# Altium project scope-hub.PrjPcb
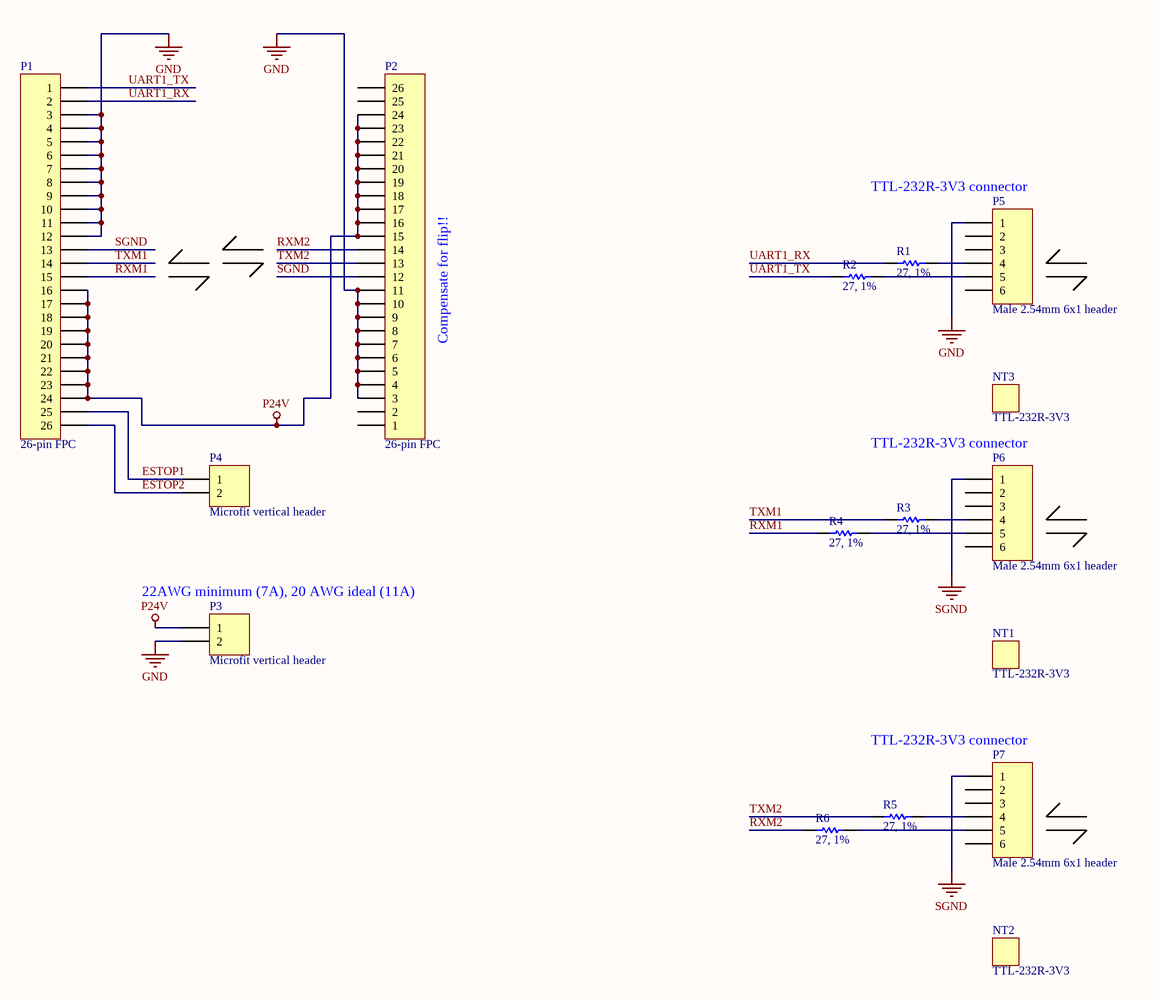
[diagram p0: hub.SchDoc]
1 sheet, 16 parts. Net scope: global (net labels, ports and power ports of the same name join across sheets).
Board file: scope-hub.PcbDoc

## Sheet hub.SchDoc
size A3; SheetNumber: 1; SheetTotal: 1

### Parts
NT1  TTL-232R-3V3
NT2  TTL-232R-3V3
NT3  TTL-232R-3V3
P1  26-pin FPC  [HRS_FH34SRJ-26S-0.5SH(50)]
P2  26-pin FPC  [HRS_FH34SRJ-26S-0.5SH(50)]
P3  Microfit vertical header  [MOLEX_0436500217]
P4  Microfit vertical header  [MOLEX_0436500217]
P5  Male 2.54mm 6x1 header  [HDR1X6]
P6  Male 2.54mm 6x1 header  [HDR1X6]
P7  Male 2.54mm 6x1 header  [HDR1X6]
R1  27, 1%  [B_RES0603]
R2  27, 1%  [B_RES0603]
R3  27, 1%  [B_RES0603]
R4  27, 1%  [B_RES0603]
R5  27, 1%  [B_RES0603]
R6  27, 1%  [B_RES0603]

### Nets
GND: P1.3 P1.4 P1.5 P1.6 P1.7 P1.8 P1.9 P1.10 P1.11 P1.12 P2.3 P2.4 P2.5 P2.6 P2.7 P2.8 P2.9 P2.10 P2.11 P3.2 P5.1
P24V: P1.16 P1.17 P1.18 P1.19 P1.20 P1.21 P1.22 P1.23 P1.24 P2.15 P2.16 P2.17 P2.18 P2.19 P2.20 P2.21 P2.22 P2.23 P2.24 P3.1
SGND: P1.13 P2.12 P6.1 P7.1
ESTOP1: P1.25 P4.1
ESTOP2: P1.26 P4.2
RXM1: P1.15 R4.1
RXM2: P2.14 R6.1
TXM1: P1.14 R3.1
TXM2: P2.13 R5.1
UART1_RX: P1.2 R1.1
UART1_TX: P1.1 R2.1
NetP5_4: P5.4 R1.2
NetP5_5: P5.5 R2.2
NetP6_4: P6.4 R3.2
NetP6_5: P6.5 R4.2
NetP7_4: P7.4 R5.2
NetP7_5: P7.5 R6.2

Not connected (* = marked no-connect by the designer): P2 1 2 25 26; P5 2 3 6; P6 2 3 6; P7 2 3 6

### Notes on the sheet
- (near P5) TTL-232R-3V3 connector
- (near P2) Compensate for flip!!
- TTL-232R-3V3 connector
- (near P3) 22AWG minimum (7A), 20 AWG ideal (11A)
- (near P7) TTL-232R-3V3 connector

### Library data of the parts
NT1-NT3 = NOTE: Placeholder for non-board BOM items; MYPN: NT-USB-SERIAL-3.3V; VENDOR: FTDI; MPN: TTL-232R-3V3
P1 P2 = FPC-26: 26 Pin FPC header; MPN: FH34SRJ-26S-0.5SH(99); MYPN: J-FPC-0.5mm-26-0.3mm-T/B; VENDOR: Hirose; System: Connector
P3 P4 = Header 2: Header, 2-Pin; MPN: 0436500217; VENDOR: Molex; LatestRevisionDate: 17-Jul-2002; LatestRevisionNote: Re-released for DXP Platform.; Publisher: Altium Limited
P5-P7 = Header 6: Header, 6-Pin; MPN: PH1-06-UA / ANY; VENDOR: Adam Tech / ANY; LatestRevisionDate: 17-Jul-2002; LatestRevisionNote: Re-released for DXP Platform.; Publisher: Altium Limited
R1-R6 = Res1: Resistor; VENDOR: ANY; MYPN: R-270-1P-1_16W-0603; MPN: ANY